# Altium schematic sheet Power Management.SchDoc
size Tabloid; SheetNumber: 2; SheetTotal: 4
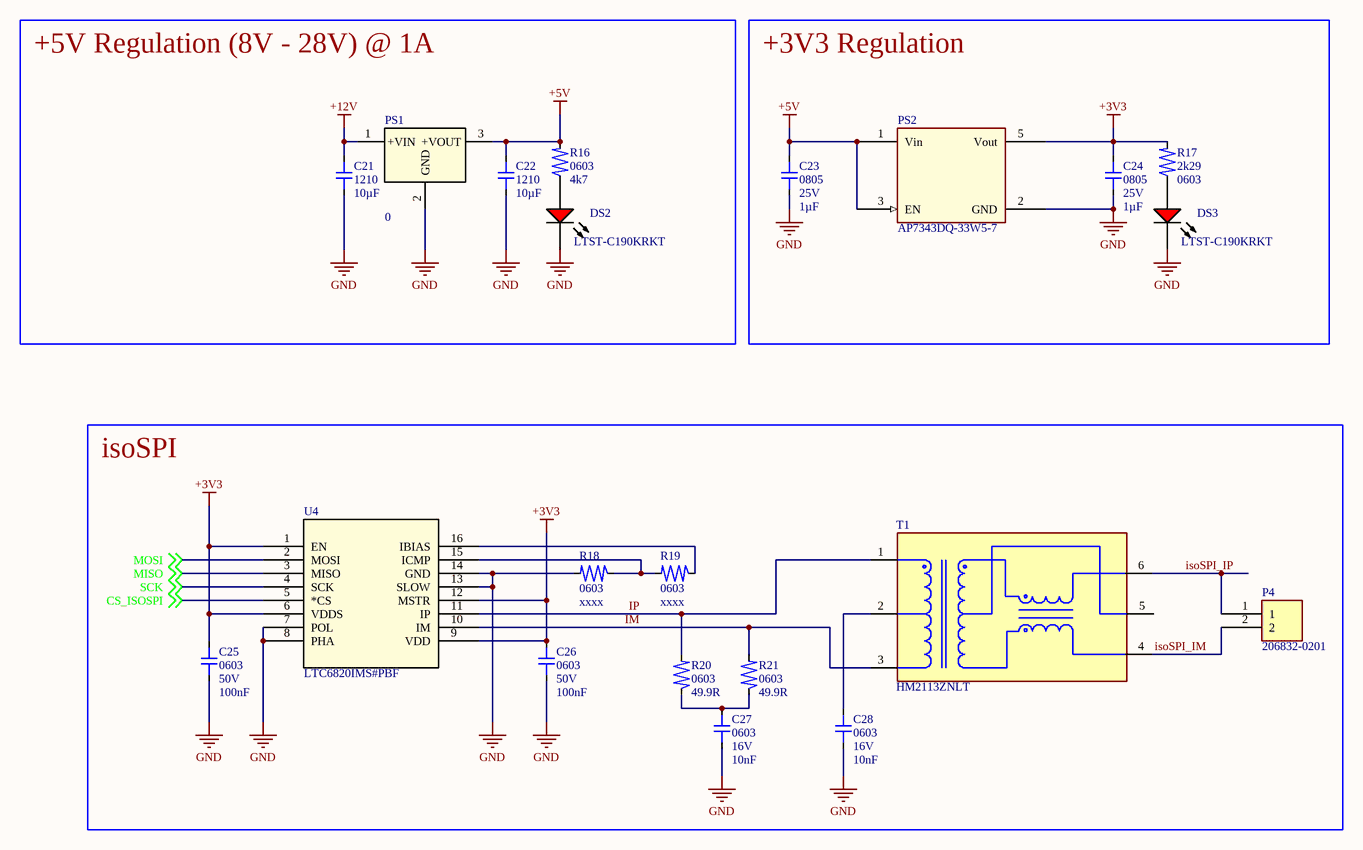
[diagram p0: Power Management.SchDoc]

## Parts
C21  value 10µF  Footprint: 1210  [FP-1210-L_3_2_0_3-W_2_5_0-MFG]  (hidden comment: Capacitor 10uF 1210 50V)
C22  value 10µF  Footprint: 1210  [FP-1210-L_3_2_0_3-W_2_5_0-MFG]  (hidden comment: Capacitor 10uF 1210 50V)
C23  value 1µF  Footprint: 0805  Voltage: 25V  [CAP-0805]  (hidden comment: Capacitor 1uF 0805 25V)
C24  value 1µF  Footprint: 0805  Voltage: 25V  [CAP-0805]  (hidden comment: Capacitor 1uF 0805 25V)
C25  value 100nF  Footprint: 0603  Voltage: 50V  [CAP-0603-Generic]  (hidden comment: Capacitor 100nF 0603 5%)
C26  value 100nF  Footprint: 0603  Voltage: 50V  [CAP-0603-Generic]  (hidden comment: Capacitor 100nF 0603 5%)
C27  value 10nF  Footprint: 0603  Voltage: 16V  [CAP-0603-Generic]  (hidden comment: Capacitor 10nF 0603 5%)
C28  value 10nF  Footprint: 0603  Voltage: 16V  [CAP-0603-Generic]  (hidden comment: Capacitor 10nF 0603 5%)
DS2  LTST-C190KRKT  [LTST-C191KRKT_V]
DS3  LTST-C190KRKT  [LTST-C191KRKT_V]
P4  206832-0201  [FP-206832-0201-MFG]
PS1  value 0  [CONV_R-78E5.0-1.0]  (hidden comment: R-78E5.0-1.0)
PS2  AP7343DQ-33W5-7  [SOT95P285X140-5N]
R16  value 4k7  Footprint: 0603  [RES-0603-Generic]  (hidden comment: Resistor 4k7 0603 1%)
R17  value 2k29  Footprint: 0603  [RES-0603-Generic]  (hidden comment: Resistor 2k49 0603 1%)
R18  value xxxx  Footprint: 0603  [RES-0603-Generic]  (hidden comment: XXX)
R19  value xxxx  Footprint: 0603  [RES-0603-Generic]  (hidden comment: XXX)
R20  value 49.9R  Footprint: 0603  [RES-0603-Generic]  (hidden comment: 49R9 0603 1%)
R21  value 49.9R  Footprint: 0603  [RES-0603-Generic]  (hidden comment: 49R9 0603 1%)
T1  HM2113ZNLT  [FP-HM2113ZNLT-MFG]
U4  LTC6820IMS#PBF  [MSOP16_MS_ADI]

## Blocks framed on the sheet
+5V Regulation (8V - 28V) @ 1A: C21 C22 DS2 PS1 R16
+3V3 Regulation: C23 C24 DS3 PS2 R17
isoSPI: C25-C28 P4 R18-R21 T1 U4

## Nets
+3V3: C24.2 C25.2 C26.2 PS2.5(Vout) R17.2 U4.1(EN) U4.6(VDDS) U4.9(VDD) U4.12(MSTR)
+5V: C22.2 C23.2 PS1.3(+VOUT) PS2.1(Vin) PS2.3(EN) R16.2
+12V: C21.2 PS1.1(+VIN)
GND: C21.1 C22.1 C23.1 C24.1 C25.1 C26.1 C27.1 C28.1 DS2.2(K) DS3.2(K) PS1.2(GND) PS2.2(GND) R18.2 U4.7(POL) U4.8(PHA) U4.13(SLOW) U4.14(GND)
CS_ISOSPI: U4.5(*CS) ; off-sheet CS_ISOSPI
IM: R21.2 T1.3 U4.10(IM)
IP: R20.2 T1.1 U4.11(IP)
isoSPI_IM: P4.2 T1.4
isoSPI_IP: P4.1 T1.6
MISO: U4.3(MISO) ; off-sheet MISO
MOSI: U4.2(MOSI) ; off-sheet MOSI
SCK: U4.4(SCK) ; off-sheet SCK
NetC27_2: C27.2 R20.1 R21.1
NetC28_2: C28.2 T1.2
NetDS2_1: DS2.1(A) R16.1
NetDS3_1: DS3.1(A) R17.1
NetR18_1: R18.1 R19.2 U4.15(ICMP)
NetR19_1: R19.1 U4.16(IBIAS)

Not connected (* = marked no-connect by the designer): PS2 4(NC); T1 5

## Notes on the sheet
- THE UNIVERSITY OF AKRON
- SHEET SIZE
- TITLE
- PART NUMBER
- REVISION
- ANSI B
- LAST UPDATE
- SHEET

## Library data of the parts
C21 C22 = CMP-001-00122-1: Capacitor 1210; Capacitor Type: Ceramic; Max Operating Temperature: 85°C; Pins: 2; Mounting Technology: Surface Mount; Case/Package: 1210; Min Operating Temperature: -55°C; RoHS Compliant: Yes; Voltage Rating: 50V
C23 C24 = CMP-00045-1: Capacitor, 0805
C25 C26 = CMP-00030-2: Capacitor, 0603, 5%; Max Operating Temperature: 125°C; Min Operating Temperature: -55°C
C27 C28 = CMP-00044-1: Capacitor, 0603, 5%; Min Operating Temperature: -55°C; Max Operating Temperature: 125°C
DS2 DS3 = CMP-007-00024-2: LED Uni-Color Red, 62.5 mW, 25 mA, -30 to 85 degC, 2-Pin SMD, RoHS, Tape and Reel; Manufacturer: Lite-On; Power: 75mW; Forward Voltage: 2V; Luminous Intensity: 54mcd; Lens Style: Diffused; Viewing Angle: 130degrees; Forward Current: 20mA; Manufacturer URL: http://www.us.liteon.com/; Case/Package: 0603; Datasheet Version: Rev. F, 05/2013; Package Reference: C191KRKT; Datasheet URL: http://optoelectronics.liteon.com/upload/download/DS-22-99-0151/S_110_LTST-C190KRKT.pdf; Package Description: 2-Pin Surface Mount Device, Body 1.6 x 0.8 mm; Nominal Vf: 2V; Packaging: TapeandReel; RoHS Compliant: True; Pins: 2; Illumination Colour: Red; Colour: Red; Mounting Technology: SM; Package Quantity: 3000; Min Operating Temperature: -55°C; Max Operating Temperature: 85°C
P4 = CMP-002-00123-3: Molex, Micro-Fit+, 2 Position, Dual-Row, Header, Male, 3mm Pitch; Max Current Rating: 13A; Voltage Rating: 600V
PS1 = CMP-009-00214-2: Linear Regulator Replacement DC DC Converter 1 Output 5V - - 1A 8V - 28V Input; MF: Recom Power; Price: None; Availability: Unavailable; SnapEDA_Link: https://www.snapeda.com/parts/R-78E5.0-1.0/Recom%20Power/view-part/557753/?ref=snap; Case/Package: SIP-3 Recom Power; Design Item ID: R-78E5.0-1.0; MP: R-78E5.0-1.0; Source: Zips_Racing_Electric.SchLib
PS2 = CMP-019-00053-6: Fixed Positive LDO Regulator; Min Supply Voltage: 1.7V; Output Current: 300mA; Max Supply Voltage: 5.25V; Output Voltage: 3.3V; Dropout Voltage: 310mV; Mounting Technology: SMT; Min Operating Temperature: -40°C; Pins: 5; Case/Package: SOT-25; Max Operating Temperature: 125°C
R16 = CMP-00023-3: Resistor, 0603, 1%, 1/10W; Power: 100mW; Tolerance: 1%; Datasheet: https://www.seielect.com/catalog/sei-rmcf_rmcp.pdf; Max Operating Temperature: 155°C; Min Operating Temperature: -55°C
R17 = CMP-00028-1: Resistor, 0603, 1%, 1/10W; Power: 100mW; Max Operating Temperature: 155°C; Min Operating Temperature: -55°C; Tolerance: 1%; Datasheet: https://www.seielect.com/catalog/sei-rmcf_rmcp.pdf
R18 R19 = CMP-00061-1: Resistor, 0603, 49R9; Tolerance: 1%; Power: 100mW; Max Operating Temperature: 155°C; Datasheet: https://www.seielect.com/catalog/sei-rmcf_rmcp.pdf; Min Operating Temperature: -55°C
R20 R21 = CMP-00061-1: Resistor, 0603, 49R9; Power: 100mW; Max Operating Temperature: 155°C; Tolerance: 1%; Datasheet: https://www.seielect.com/catalog/sei-rmcf_rmcp.pdf; Min Operating Temperature: -55°C
T1 = CMP-012-00001-1: Datacom Transformer; RoHS Compliant: Yes; Transformer Type: DATACOM TRANSFORMER
U4 = CMP-023-000016-1: Isolated Communications Interface Interface 16-MSOP; Mfr_Name: Analog Devices Inc; Source: Zips_Racing_Electric.SchLib; Type: DEV; Manufacturer_Part_Number: LTC6820IMS#PBF; Digi-Key_Part_Number_1: LTC6820IMS#PBF-ND; RefDes: RefDes; Copyright: Copyright (C) 2021 Ultra Librarian. All rights reserved.; Design Item ID: LTC6820IMS#PBF